# EAGLE design led-controller (EAGLE 9.6.2)
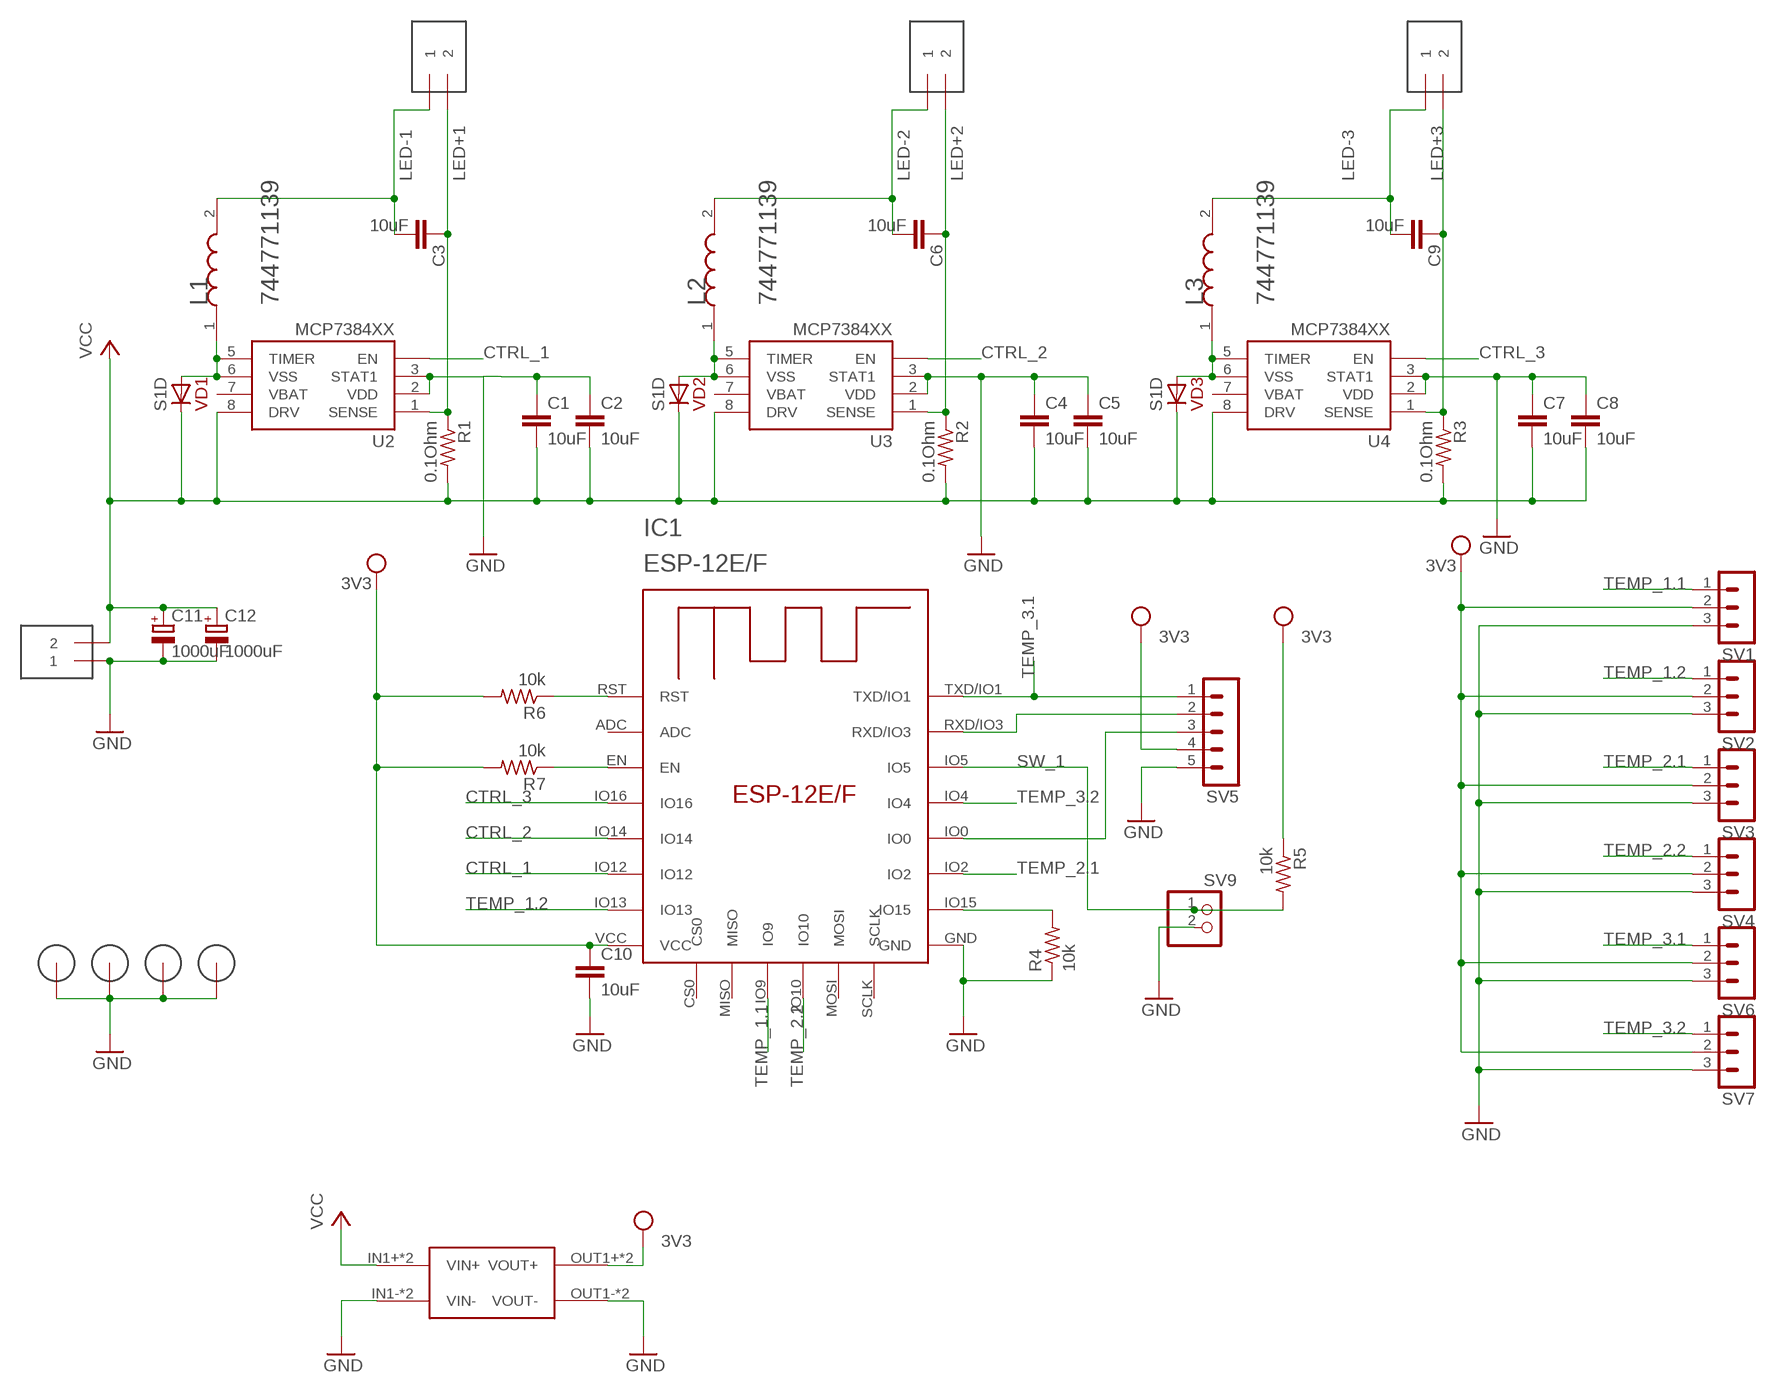
[diagram p0: schematic, sheet 1]

## Parts
C1  10uF  C-EUC0805K  [C0805K]
C2  10uF  C-EUC0805K  [C0805K]
C3  10uF  C-EUC0805K  [C0805K]
C4  10uF  C-EUC0805K  [C0805K]
C5  10uF  C-EUC0805K  [C0805K]
C6  10uF  C-EUC0805K  [C0805K]
C7  10uF  C-EUC0805K  [C0805K]
C8  10uF  C-EUC0805K  [C0805K]
C9  10uF  C-EUC0805K  [C0805K]
C10  10uF  C-EUC0805K  [C0805K]
C11  1000uF  CPOL-EUE5-13  [E5-13]
C12  1000uF  CPOL-EUE5-13  [E5-13]
H1  3MM_HOLE  [3MM_HOLE]
H2  3MM_HOLE  [3MM_HOLE]
H3  3MM_HOLE  [3MM_HOLE]
H4  3MM_HOLE  [3MM_HOLE]
IC1  ESP-12E/F  [ESP-12E]
L1  39uH  WURTH_ELECTRONICS_744771139WURTH_ELECTRONICS_744771139_0_0  [WURTH_ELECTRONICS_744771139_0]
L2  39uH  WURTH_ELECTRONICS_744771139WURTH_ELECTRONICS_744771139_0_0  [WURTH_ELECTRONICS_744771139_0]
L3  39uH  WURTH_ELECTRONICS_744771139WURTH_ELECTRONICS_744771139_0_0  [WURTH_ELECTRONICS_744771139_0]
R1  0.1Ohm  R-US_R1206  [R1206]
R2  0.1Ohm  R-US_R1206  [R1206]
R3  0.1Ohm  R-US_R1206  [R1206]
R4  10k  R-US_R0805  [R0805]
R5  10k  R-US_R0805  [R0805]
R6  10k  R-US_R0805  [R0805]
R7  10k  R-US_R0805  [R0805]
SV1  MA03-1  [MA03-1]
SV2  MA03-1  [MA03-1]
SV3  MA03-1  [MA03-1]
SV4  MA03-1  [MA03-1]
SV5  MA05-1  [MA05-1]
SV6  MA03-1  [MA03-1]
SV7  MA03-1  [MA03-1]
SV9  PINHD-1X2  [1X02]
U2  MCP7384XX  [MSOP8]
U3  MCP7384XX  [MSOP8]
U4  MCP7384XX  [MSOP8]
U$3  TERMINAL_2P  [KF301-2P]
U$5  TERMINAL_2P  [KF301-2P]
U$7  TERMINAL_2P  [KF301-2P]
U$8  TERMINAL_2P  [KF301-2P]
U$10  MP1584  [DC-BRICK]
VD1  S1D  [DO214AC]
VD2  S1D  [DO214AC]
VD3  S1D  [DO214AC]

## Nets
3V3: C10.1 IC1.VCC R5.1 R6.2 R7.2 SV1.2 SV2.2 SV3.2 SV4.2 SV5.4 SV6.2 SV7.2 U$10.OUT1+(VOUT+) U$10.OUT2+(VOUT+) ; supply symbol labelled VCC
CTRL_1: IC1.IO12 U2.4(EN)
CTRL_2: IC1.IO14 U3.4(EN)
CTRL_3: IC1.IO16 U4.4(EN)
GND: C1.1 C2.1 C4.1 C5.1 C7.1 C8.1 C10.2 C11.- C12.- H1.P$1(GND) H1.P$2(GND) H1.P$3(GND) H1.P$4(GND) H1.P$5(GND) H1.P$6(GND) H1.P$7(GND) H1.P$8(GND) H1.P$9(GND) H2.P$1(GND) H2.P$2(GND) H2.P$3(GND) H2.P$4(GND) H2.P$5(GND) H2.P$6(GND) H2.P$7(GND) H2.P$8(GND) H2.P$9(GND) H3.P$1(GND) H3.P$2(GND) H3.P$3(GND) H3.P$4(GND) H3.P$5(GND) H3.P$6(GND) H3.P$7(GND) H3.P$8(GND) H3.P$9(GND) H4.P$1(GND) H4.P$2(GND) H4.P$3(GND) H4.P$4(GND) H4.P$5(GND) H4.P$6(GND) H4.P$7(GND) H4.P$8(GND) H4.P$9(GND) IC1.GND R4.1 SV1.3 SV2.3 SV3.3 SV4.3 SV5.5 SV6.3 SV7.3 SV9.2 U2.2(VDD) U2.3(STAT1) U3.2(VDD) U3.3(STAT1) U4.2(VDD) U4.3(STAT1) U$8.1 U$10.IN1-(VIN-) U$10.IN2-(VIN-) U$10.OUT1-(VOUT-) U$10.OUT2-(VOUT-)
LED+1: C3.1 R1.1 U2.1(SENSE) U$3.2
LED+2: C6.1 R2.1 U3.1(SENSE) U$5.2
LED+3: C9.1 R3.1 U4.1(SENSE) U$7.2
LED-1: C3.2 L1.2 U$3.1
LED-2: C6.2 L2.2 U$5.1
LED-3: C9.2 L3.2 U$7.1
N$1: IC1.RST R6.1
N$2: IC1.EN R7.1
N$3: L2.1 U3.5(TIMER) U3.6(VSS) VD2.A
N$5: L3.1 U4.5(TIMER) U4.6(VSS) VD3.A
N$6: L1.1 U2.5(TIMER) U2.6(VSS) VD1.A
N$7: IC1.IO15 R4.2
N$9: IC1.IO0 SV5.3
N$10: IC1.RXD/IO3 SV5.2
SW_1: IC1.IO5 R5.2 SV9.1
TEMP_1.1: IC1.IO9 SV1.1
TEMP_1.2: IC1.IO13 SV2.1
TEMP_2.1: IC1.IO2 SV3.1
TEMP_2.2: IC1.IO10 SV4.1
TEMP_3.1: IC1.TXD/IO1 SV5.1 SV6.1
TEMP_3.2: IC1.IO4 SV7.1
VCC: C1.2 C2.2 C4.2 C5.2 C7.2 C8.2 C11.+ C12.+ R1.2 R2.2 R3.2 U2.8(DRV) U3.8(DRV) U4.8(DRV) U$8.2 U$10.IN1+(VIN+) U$10.IN2+(VIN+) VD1.C VD2.C VD3.C
Unconnected: IC1.ADC IC1.CS0 IC1.MISO IC1.MOSI IC1.SCLK U2.7(VBAT) U3.7(VBAT) U4.7(VBAT)

## Library data of the parts
C1-C10 = rcl:C-EU: CAPACITOR, European symbol; SPICEPREFIX: C
C11 C12 = rcl:CPOL-EU: POLARIZED CAPACITOR, European symbol; SPICEPREFIX: C
H1-H4 = 3mm_special_hole:3MM_HOLE: Cool looking 3mm hole with ground connection
IC1 = esp-12e-f:ESP-12E/F
L1-L3 = Wurth Electronics - 744771139:WURTH_ELECTRONICS_744771139: PAS-IND-INDUCTOR-2; COMPONENT_LINK_1_DESCRIPTION: Manufacturer Link; COMPONENT_LINK_1_URL: http://www.we-online.com; DATASHEET: http://www.we-online.de/katalog/media/pdf/744771139.pdf; DATASHEET_VERSION: ver 6, Jun-2005; IMPORTED: yes; IMPORTED_FROM: vault; IMPORT_TS: 1521177220; INDUCTANCE: 39.0 ÂμH; MF: Wurth Electronics; MPN: 744771139; PACKAGE: WE-PD-L; PACKAGE_DESCRIPTION: SMD Inductor, 2-Leads, Body 12.0 x 12.0 mm; PACKAGE_VERSION: 2006; PREFIX: L; VAULT_GUID: C2B86D89-6DCB-4AF3-816A-E456D16F5C21; VAULT_REVISION: 0D4D0C67-8F6F-44F5-A537-2B3B09CFB03B
R1-R7 = rcl:R-US_: RESISTOR, American symbol; SPICEPREFIX: R
SV1-SV4 SV6 SV7 = con-lstb:MA03-1: PIN HEADER; OC_FARNELL: unknown; OC_NEWARK: unknown
SV5 = con-lstb:MA05-1: PIN HEADER; OC_FARNELL: unknown; OC_NEWARK: unknown
SV9 = pinhead:PINHD-1X2: PIN HEADER
U2-U4 = SparkFun-IC-Power:MCP7384XX: Li-Ion charge controller family from Microchip (IC-08344)
U$3 U$5 U$7 U$8 = KF301-2P-Terminal:TERMINAL_2P: Terminal Screw 2 Port 5mm Pitch
U$10 = MP1584-dc-brick:MP1584: MP1584-dc-brick-pcb Step down Input: 4.5V - 28V Ouput 0.8V - 25V max. 3A Cheap on ebay
VD1-VD3 = diodes:?; MOUSER: 625-S1DHE3

## Board
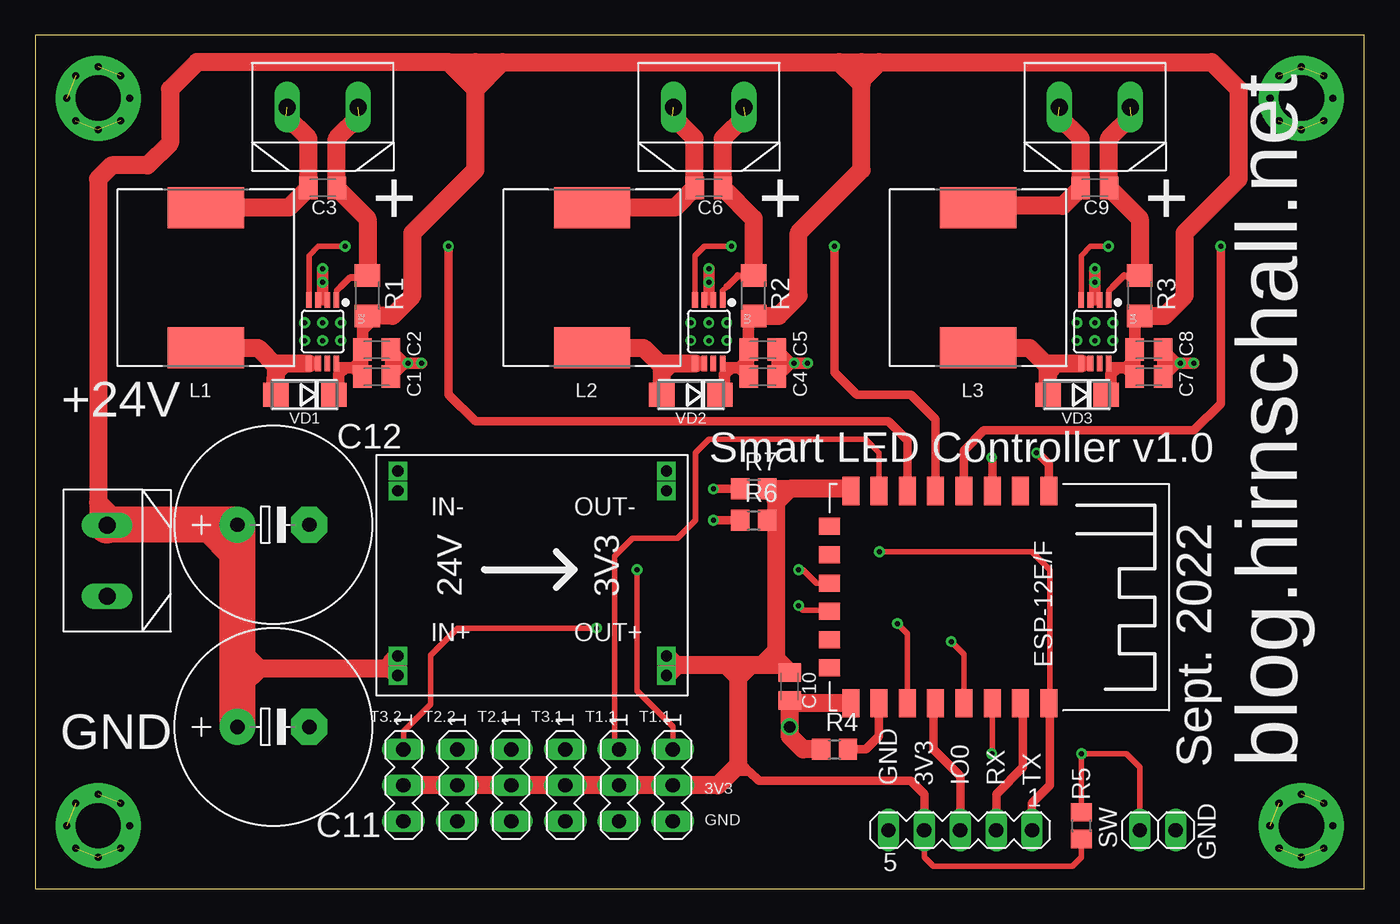
[diagram p1: board, top side]
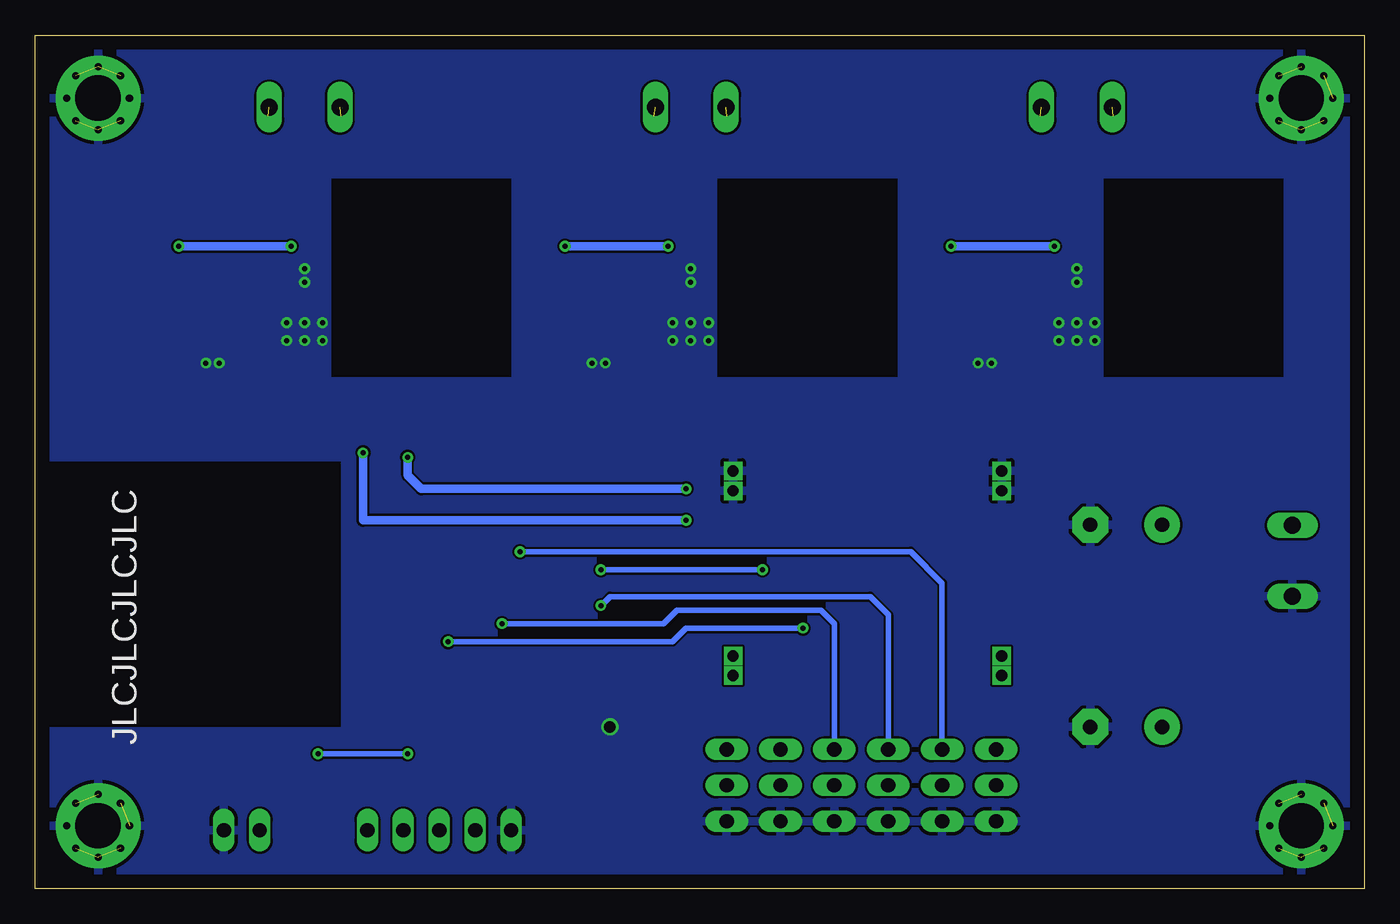
[diagram p2: board, bottom side, seen from below]

Size 93.97 x 60.31 mm. Coordinates in mm from the lower left corner, seen from the top.
Outline: 0,0 93.97,0 93.97,60.31 0,60.31 0,0
Copper layers (1*16): Top 0.035mm / dielectric 1.5mm / Bottom 0.035mm
Design rules "default": minimum track width 6mil, minimum drill 0.35mm, track to track 6mil, track to pad 6mil, pad to pad 6mil, via to via 6mil, smd to smd 6mil, copper to edge 40mil, drill to drill 6mil, minimum pad ring 10mil, minimum via ring 8mil, stop-mask expansion 4mil, vias tented up to drill 0mil, thermal gap 10mil
bRestrict: area 5.7,36.2 to 18.4,50.2; area 33,36.2 to 45.7,50.2; area 60.3,36.2 to 73,50.2; area 72.4,11.4 to 96.5,30.2

### Footprints (pad centres in the part's own frame; a part is rotated, then mirrored left to right if it is on the bottom)
C0805K = smd 1.3 x 1.6: 1 -1,0; 2 1,0
E5-13 = drill 1.016 pad 2.54: + -2.54,0 | drill 1.016 pad 2.54 octagon: - 2.54,0
3MM_HOLE = drill 3.2 pad 6: P$1 0,0 | drill 0.5 pad 0.61: P$2 0,2.223; P$3 0,-2.223; P$4 2.223,0; P$5 -2.223,0; P$6 -1.587,1.587; P$7 1.587,1.587; P$8 1.587,-1.587; P$9 -1.587,-1.587
ESP-12E = smd 2 x 1.2: ADC -7.46,5.53; EN -7.46,3.53; GND 7.54,-6.47; IO0 7.54,-0.47; IO2 7.54,-2.47; IO4 7.54,1.53; IO5 7.54,3.53; IO12 -7.46,-2.47; IO13 -7.46,-4.47; IO14 -7.46,-0.47; IO15 7.54,-4.47; IO16 -7.46,1.53; RST -7.46,7.53; RXD/IO3 7.54,5.53; TXD/IO1 7.54,7.53; VCC -7.46,-6.47 | smd 1.2 x 1.5: CS0 -4.96,-7.97; IO9 -0.96,-7.97; IO10 1.04,-7.97; MISO -2.96,-7.97; MOSI 3.04,-7.97; SCLK 5.04,-7.97
WURTH_ELECTRONICS_744771139_0 = smd 2.9 x 5.4: 1 -4.95,0; 2 4.95,0
R1206 = smd 1.6 x 1.803: 1 -1.422,0; 2 1.422,0
R0805 = smd 1.3 x 1.5: 1 -0.95,0; 2 0.95,0
MA03-1 = drill 1.016 long: 1 -2.54,0; 2 0,0; 3 2.54,0
MA05-1 = drill 1.016 long: 1 -5.08,0; 2 -2.54,0; 3 0,0; 4 2.54,0; 5 5.08,0
1X02 = drill 1.016 long: 1 -1.27,0; 2 1.27,0
MSOP8 = smd 0.4 x 1.1: 1 -0.975,-2.25; 2 -0.325,-2.25; 3 0.325,-2.25; 4 0.975,-2.25; 5 0.975,2.25; 6 0.325,2.25; 7 -0.325,2.25; 8 -0.975,2.25
KF301-2P = drill 1.2 pad 1.778 long: 1 -2.5,0; 2 2.5,0
DC-BRICK = drill 0.8 square: IN1+ 1.5,1.4; IN1- 1.5,14.47; IN2+ 1.5,2.8; IN2- 1.5,15.87; OUT1+ 20.5,1.4; OUT1- 20.5,14.47; OUT2+ 20.5,2.8; OUT2- 20.5,15.87
DO214AC = smd 1.8 x 1.7: A 2.05,0; C -2.05,0

### Placement (x,y rotation side)
C1  24.13,36.2 180 top
C2  24.13,38.1 180 top
C3  20.32,49.53 180 top
C4  51.44,36.2 180 top
C5  51.44,38.1 180 top
C6  47.62,49.53 180 top
C7  78.74,36.2 180 top
C8  78.74,38.1 180 top
C9  74.93,49.53 180 top
C10  53.34,14.29 270 top
C11  16.83,11.43 0 top
C12  16.83,25.72 0 top
H1  4.45,55.88 0 top
H2  4.45,4.45 0 top
H3  89.53,4.45 0 top
H4  89.53,55.88 0 top
IC1  64.14,20.64 270 top
L1  12.06,43.18 90 top
L2  39.37,43.18 90 top
L3  66.67,43.18 90 top
R1  23.5,41.91 270 top
R2  50.8,41.91 270 top
R3  78.11,41.91 270 top
R4  56.52,9.84 0 top
R5  73.98,4.45 90 top
R6  50.8,26.04 0 top
R7  50.8,28.26 0 top
SV1  45.09,7.3 270 top
SV2  41.27,7.3 270 top
SV3  37.47,7.3 270 top
SV4  33.66,7.3 270 top
SV5  65.41,4.13 180 top
SV6  29.84,7.3 270 top
SV7  26.04,7.3 270 top
SV9  79.38,4.13 0 top
U2  20.32,39.37 180 top
U3  47.62,39.37 180 top
U4  74.93,39.37 180 top
U$3  20.32,55.24 0 top
U$5  47.62,55.24 0 top
U$7  74.93,55.24 0 top
U$8  5.08,23.18 90 top
U$10  24.13,13.65 0 top
VD1  19.05,34.92 180 top
VD2  46.35,34.92 180 top
VD3  73.66,34.92 180 top

### Tracks (layer width: path | path; a pad name or v marks a point on that pad's centre or on a via)
3V3
  Top 0.406: SV5.4 62.87,2.22 63.5,1.59 73.34,1.59 73.98,2.22 R5.1
  Top 0.61: SV5.4 62.87,6.67 61.91,7.62 51.16,7.62 50.5,8.28 | 50.03,8.75 49.71,9.07 | 49.71,8.75 50.03,8.75 | 50.03,8.75 50.5,8.28 | 50.5,8.28 50.48,8.26 49.21,8.26
  Top 1.27: 45.4,15.82 45.27,15.82 U$10.OUT2+ U$10.OUT1+ 45.4,15.82 | 45.4,15.82 48.9,15.82 | 48.9,15.82 49.71,15.82 | IC1.VCC 57.51,28.26 53.34,28.26 | 49.71,14.92 49.71,9.07 49.71,8.75 49.21,8.26 48.26,7.3 SV1.2 SV2.2 SV3.2 SV4.2 SV6.2 SV7.2 | 49.71,15.82 49.71,14.92 | 52.81,15.82 52.39,16.24 52.39,16.77 | 52.81,15.82 C10.1 | 52.39,27.3 52.39,27.94 52.7,28.26 | 52.39,27.3 52.39,26.04 | 52.39,26.04 52.39,16.77 | 49.71,15.82 50.6,15.82 | 50.6,15.82 51.44,15.82 | 51.44,15.82 52.81,15.82 | 52.39,16.77 51.44,15.82 | 49.71,14.92 50.6,15.82 | 49.71,14.92 48.9,15.74 48.9,15.82 | R6.2 52.39,26.04 | R7.2 52.7,28.26 | 52.7,28.26 53.34,28.26 | 53.34,28.26 52.39,27.3
CTRL_1  (via drill 0.35)
  Top 0.406: U2.4 19.34,44.74 20,45.4 v21.91,45.4
  Top 0.61: v29.21,45.4 29.21,34.92 31.11,33.02 60.33,33.02 61.66,31.68 IC1.IO12
  Bottom 0.61: v29.21,45.4 v21.91,45.4
CTRL_2  (via drill 0.35)
  Top 0.406: v49.21,45.4 47.31,45.4 46.65,44.74 U3.4
  Top 0.61: IC1.IO14 63.66,33.17 61.91,34.92 58.1,34.92 56.52,36.51 v56.52,45.4
  Bottom 0.61: v56.52,45.4 v49.21,45.4
CTRL_3  (via drill 0.35)
  Top 0.406: U4.4 73.95,44.74 74.61,45.4 v75.88,45.4
  Top 0.61: v83.82,45.4 83.82,34.29 81.92,32.38 67.09,32.38 65.67,30.95 IC1.IO16
  Bottom 0.61: v83.82,45.4 v75.88,45.4
GND  (via drill 0.35, 0.8)  (16 unrouted)
  Top 0.406: U2.2 20.32,41.62 U2.3 | U3.3 47.62,41.62 U3.2 | U4.3 74.93,41.62 U4.2
  Top 0.813: 20.32,41.62 v20.32,42.86 v20.32,43.81 | 47.62,41.62 v47.62,42.86 v47.62,43.81 | 74.93,41.62 v74.93,42.86 v74.93,43.81 | 79.74,37.15 C8.1 80.69,37.15 | 79.74,37.15 C7.1 80.69,37.15 | 52.44,37.15 C5.1 53.39,37.15 | 52.44,37.15 C4.1 53.39,37.15 | 25.13,37.15 C2.1 26.08,37.15 | 25.13,37.15 C1.1 26.08,37.15 | 25.13,37.15 v26.35,37.15 | 52.44,37.15 v53.66,37.15 | 79.74,37.15 v80.96,37.15 | v80.96,37.15 80.69,37.15 | v53.66,37.15 53.39,37.15 | v26.35,37.15 26.08,37.15 | v26.35,37.15 v27.3,37.15 | v53.66,37.15 v54.61,37.15 | v80.96,37.15 v81.92,37.15
  Top 1.27: IC1.GND 53.53,13.1 C10.2 v53.34,11.43 53.34,10.8 54.3,9.84 R4.1
  other vias: 19.05,40.01 20.32,40.01 21.59,40.01 19.05,38.73 20.32,38.73 21.59,38.73 46.35,40.01 46.35,38.73 47.62,40.01 47.62,38.73 48.9,38.73 48.9,40.01 73.66,40.01 73.66,38.73 74.93,38.73 74.93,40.01 76.2,40.01 76.2,38.73
  pour Bottom: 0,60.33 0,0 93.98,0 93.98,60.33
LED+1  (1 unrouted)
  Top 0.406: U2.1 21.3,42.25 21.59,42.55
  Top 0.508: 21.59,42.55 22.23,43.18 23.34,43.18 R1.1
  Top 1.27: R1.1 23.5,47.35 C3.1 21.32,53.03 22.9,54.61
LED+2  (1 unrouted)
  Top 0.406: U3.1 48.6,42.25 48.9,42.55
  Top 0.508: R2.1 49.68,43.33 48.9,42.55
  Top 1.27: R2.1 50.8,47.35 C6.1 48.62,53.03 50.2,54.61
LED+3  (1 unrouted)
  Top 0.406: U4.1 75.91,42.25 76.2,42.55
  Top 0.508: R3.1 76.99,43.33 76.2,42.55
  Top 1.27: R3.1 78.11,47.35 C9.1 75.93,53.03 77.51,54.61
LED-1  (1 unrouted)
  Top 1.27: L1.2 17.92,48.13 C3.2 19.32,53.03 17.74,54.61
LED-2  (1 unrouted)
  Top 1.27: L2.2 45.23,48.13 C6.2 46.62,53.03 45.05,54.61
LED-3  (1 unrouted)
  Top 0.813: 66.67,48.26 L3.2
  Top 1.27: 66.67,48.26 72.66,48.26 C9.2 73.93,53.03 72.35,54.61
N$1  (via drill 0.35)
  Top 0.61: R6.1 v47.94,26.04 | IC1.RST 71.67,30 70.87,30.8 v70.8,30.8
  Bottom 0.61: v47.94,26.04 70.8,26.04 v70.8,30.8
N$2  (via drill 0.35)
  Top 0.61: R7.1 v47.94,28.26 | v67.63,30.48 67.67,30.44 IC1.EN
  Bottom 0.61: v47.94,28.26 66.67,28.26 67.63,29.21 v67.63,30.48
N$3
  Top 0.406: U3.6 U3.5
  Top 0.813: 42.99,38.23 44.1,37.12 44.3,36.92 44.3,36.34 | 44.3,36.34 44.3,36.2 45.09,36.98 45.09,37.12 44.3,36.34
  Top 1.27: L2.1 42.99,38.23 44.3,36.92 44.3,36.2 VD2.A | 44.1,37.12 45.09,37.12 U3.5
N$5
  Top 0.406: U4.6 U4.5
  Top 0.813: 72.39,37.12 72.53,37.12 | 72.39,37.12 71.75,37.12 71.41,37.12 | 70.3,38.23 71.41,37.12 | 71.41,37.12 71.61,36.92 71.61,36.34 | 71.61,36.34 71.61,36.2 72.53,37.12 | 71.61,36.34 72.39,37.12 | 72.53,37.12 73.03,37.12
  Top 1.27: L3.1 70.3,38.23 71.61,36.92 71.61,36.2 VD3.A | 71.75,37.12 73.03,37.12 U4.5
N$6
  Top 0.406: U2.6 U2.5
  Top 0.813: 17,36.34 17,36.2 17.78,36.98 17.78,37.12 17,36.34 | 17,36.34 17,36.98 17.14,37.12
  Top 1.27: L1.1 15.74,38.23 17,36.98 17,36.2 VD1.A | 17.14,37.12 17.78,37.12 U2.5
N$7
  Top 0.61: IC1.IO15 59.66,10.77 58.74,9.84 R4.2
N$9
  Top 0.61: SV5.3 65.41,7.94 63.5,9.84 63.5,12.93 IC1.IO0
N$10
  Top 0.61: SV5.2 67.94,6.67 69.85,8.57 69.85,12.91 IC1.RXD/IO3
SW_1  (via drill 0.35)
  Top 0.406: IC1.IO5 67.67,9.8 v67.63,9.53 | SV9.1 78.11,8.57 77.15,9.53 v73.98,9.53 R5.2
  Bottom 0.406: v73.98,9.53 v67.63,9.53
TEMP_1.1  (via drill 0.35)
  Top 0.406: v53.98,22.54 54.29,22.54 55.24,21.6 IC1.IO9 | SV1.1 45.09,11.43 42.55,13.97 v42.55,22.54
  Bottom 0.406: v53.98,22.54 v42.55,22.54
TEMP_1.2
  Top 0.406: IC1.IO13 59.66,30.82 58.74,31.75 47.62,31.75 46.67,30.8 46.67,26.04 45.4,24.77 42.23,24.77 40.96,23.5 40.96,10.16 SV2.1
TEMP_2.1  (via drill 0.35)
  Top 0.406: v60.96,18.73 61.66,18.03 IC1.IO2
  Bottom 0.406: v60.96,18.73 49.53,18.73 48.58,19.68 38.42,19.68 37.47,18.73 SV3.1
TEMP_2.2  (via drill 0.35)
  Top 0.406: v53.98,20 54.29,19.68 56.08,19.68 IC1.IO10
  Bottom 0.406: v53.98,20 53.34,20.64 34.92,20.64 33.66,19.37 SV4.1
TEMP_3.1  (via drill 0.35)
  Top 0.406: v59.69,23.81 70.48,23.81 71.75,22.54 71.75,13.01
  Top 0.61: SV5.1 70.48,6.03 71.75,7.3 71.75,13.01 IC1.TXD/IO1
  Bottom 0.406: v59.69,23.81 32.07,23.81 29.84,21.59 SV6.1
TEMP_3.2  (via drill 0.35)
  Top 0.406: v64.77,17.46 65.67,16.57 IC1.IO4 | SV7.1 26.04,11.11 27.94,13.02 27.94,16.51 29.84,18.41 v39.69,18.41
  Bottom 0.406: v39.69,18.41 47.94,18.41 48.9,17.46 v64.77,17.46
VCC
  Top 0.406: 21.59,36.83 U2.8 21.3,36.2 | 48.6,36.2 U3.8 48.89,36.83 | 75.91,36.2 U4.8 76.19,36.83 76.2,36.83
  Top 0.508: 21.3,35.12 21.3,36.2 21.44,36.34 | VD2.C 48.6,35.12 48.6,36.2 48.75,36.34 | 48.89,36.83 49.23,36.83 | VD3.C 75.91,35.12 75.91,36.2 76.05,36.34
  Top 0.813: 21.3,35.12 VD1.C 21.44,35.27 21.44,36.34 21.93,36.83 | 23.13,39.49 23.13,40.12 R1.2 24.13,40.49 | 23.13,39.49 C2.2 | C2.2 23.13,37.47 22.5,36.83 | C2.2 C1.2 22.5,36.83 | 22.5,36.83 21.93,36.83 | 21.93,36.83 21.59,36.83 | 24.13,40.49 25.25,40.49 | 23.13,39.49 24.13,40.49 | R2.2 50.44,40.12 C5.2 | C5.2 C4.2 49.8,36.83 | C5.2 50.44,37.47 49.8,36.83 | 49.8,36.83 48.89,36.83 | C7.2 77.74,36.83 | 77.74,36.83 C8.2 | C8.2 77.74,40.49 R3.2 | 76.2,36.83 76.54,36.83 | 76.54,36.83 77.11,36.83 | 77.11,36.83 77.74,36.83 | C7.2 77.11,36.83 | C7.2 C8.2 | C8.2 77.74,37.47 77.11,36.83 | 48.6,35.12 48.75,35.27 48.75,36.34 49.23,36.83 | VD3.C 76.05,35.27 76.05,36.34 76.54,36.83
  Top 1.27: 29.21,58.42 31.11,58.42 | 31.11,58.42 33.02,58.42 | 33.02,58.42 56.83,58.42 | 56.83,58.42 58.42,58.42 | 58.42,58.42 59.69,58.42 | 59.69,58.42 83.19,58.42 85.09,56.52 85.09,50.16 81.28,46.35 81.28,41.91 79.86,40.49 R3.2 | R1.2 25.25,40.49 26.67,41.91 26.67,46.35 31.11,50.8 31.11,56.52 | R2.2 52.55,40.49 53.98,41.91 53.98,46.35 58.42,50.8 58.42,56.83 | 31.11,58.42 31.11,56.52 | 58.42,58.42 58.42,56.83 | 29.21,58.42 31.11,56.52 | 31.11,56.52 33.02,58.42 | 56.83,58.42 58.26,56.99 | 58.26,56.99 58.42,56.83 | 58.26,56.99 59.69,58.42 | 29.21,58.42 11.43,58.42 9.53,56.52 9.53,52.7 7.94,51.12 5.4,51.12 4.45,50.16 4.45,27.3 | 25.12,15.56 15.88,15.56 | 14.29,15.56 15.88,15.56 | 15.88,15.56 14.92,16.51 | 15.88,15.56 14.61,14.29 14.29,14.29 | 25.12,15.56 25.12,15.95 U$10.IN2+ U$10.IN1+ 25.12,15.56 | 13.69,23.81 14.29,23.81 | U$8.2 4.45,26.31 4.45,27.3 | 4.45,27.3 5.12,26.63 5.12,25.72
  Top 2.54: 14.29,23.81 C12.+ 12.38,25.72 | 14.29,23.81 14.29,15.56 14.29,14.29 C11.+ | 12.38,25.72 5.12,25.72 U$8.2 | 12.38,25.72 14.29,23.81

### Text on the board
tNames: + | + | + | +24V | Smart LED Controller v1.0 | 24V | 3V3 | GND | T3.2 | T2.2 | T2.1 | T3.1 | T1.1 | T1.1 | Sept. 2022 | blog.hirnschall.net | 3V3 | GND | 3V3 | IO0 | RX | TX | GND | GND | SW
bNames: JLCJLCJLCJLC